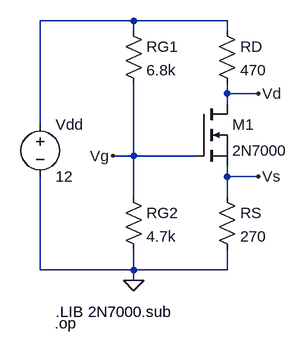
[diagram p0: schematic PreLab3.asc]
PreLab3.asc, the LTspice schematic file:
Version 4
SHEET 1 880 680
WIRE 96 32 -48 32
WIRE 240 32 96 32
WIRE 96 48 96 32
WIRE 240 48 240 32
WIRE 240 144 240 128
WIRE 288 144 240 144
WIRE 240 160 240 144
WIRE -48 192 -48 32
WIRE 96 240 96 128
WIRE 96 240 64 240
WIRE 192 240 96 240
WIRE 240 272 240 256
WIRE 288 272 240 272
WIRE 96 304 96 240
WIRE 240 304 240 272
WIRE -48 416 -48 272
WIRE 96 416 96 384
WIRE 96 416 -48 416
WIRE 240 416 240 384
WIRE 240 416 96 416
WIRE 96 432 96 416
FLAG 288 144 Vd
FLAG 288 272 Vs
FLAG 64 240 Vg
FLAG 96 432 0
SYMBOL res 80 32 R0
SYMATTR InstName RG1
SYMATTR Value 6.8k
SYMBOL res 80 288 R0
SYMATTR InstName RG2
SYMATTR Value 4.7k
SYMBOL res 224 32 R0
SYMATTR InstName RD
SYMATTR Value 470
SYMBOL res 224 288 R0
SYMATTR InstName RS
SYMATTR Value 270
SYMBOL nmos 192 160 R0
SYMATTR InstName M1
SYMATTR Value 2N7000
SYMBOL voltage -48 176 R0
WINDOW 123 0 0 Left 0
WINDOW 39 0 0 Left 0
SYMATTR InstName Vdd
SYMATTR Value 12
TEXT -26 498 Left 2 !.op
TEXT -24 480 Left 2 !.LIB 2N7000.sub

The netlist it stands for:
* PreLab3.asc
RG1 N001 Vg 6.8k
RG2 Vg 0 4.7k
RD N001 Vd 470
RS Vs 0 270
M1 Vd Vg Vs Vs 2N7000
Vdd N001 0 12
.model NMOS NMOS
.model PMOS PMOS
.lib standard.mos
.op
.LIB 2N7000.sub
.backanno
.end